# Altium schematic sheet SD_CARD.SchDoc
size A4; SheetNumber: 14; SheetTotal: 15
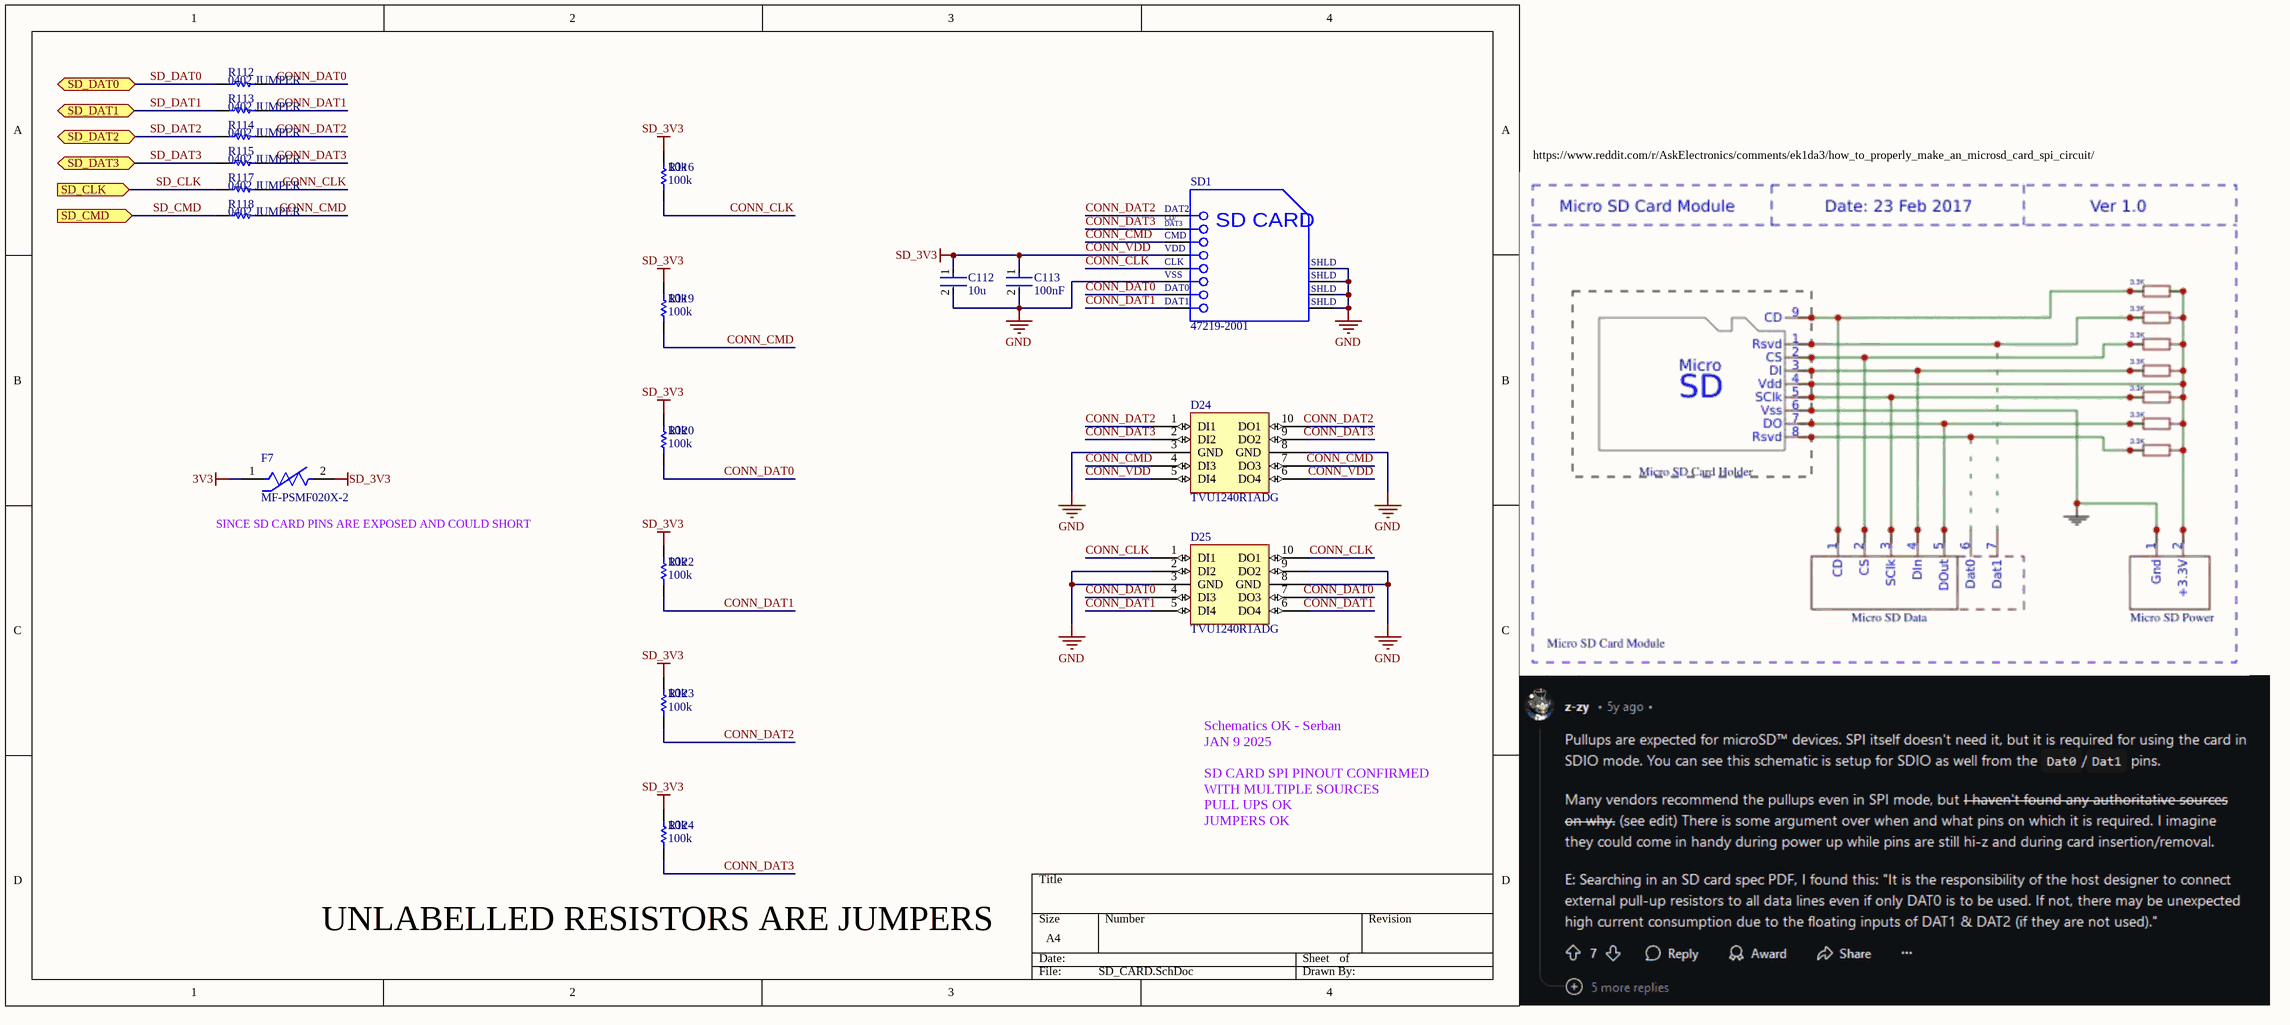
[diagram p0: SD_CARD.SchDoc]

## Parts
C112  10u  [FP-0402-L_1_0_0_05-W_0_5-IPC_A]
C113  100nF  [FP-0402-L_1_0_0_05-W_0_5-IPC_A]
D24  TVU1240R1ADG  [CAF-50P250X100-10N]
D25  TVU1240R1ADG  [CAF-50P250X100-10N]
F7  MF-PSMF020X-2  [FP-MF-PSMF-MFG]
R112  0402 JUMPER  [RESC1005X40X25ML05T05]
R113  0402 JUMPER  [RESC1005X40X25ML05T05]
R114  0402 JUMPER  [RESC1005X40X25ML05T05]
R115  0402 JUMPER  [RESC1005X40X25ML05T05]
R116  100k  value 10k  [R0603B]
R117  0402 JUMPER  [RESC1005X40X25ML05T05]
R118  0402 JUMPER  [RESC1005X40X25ML05T05]
R119  100k  value 10k  [R0603B]
R120  100k  value 10k  [R0603B]
R122  100k  value 10k  [R0603B]
R123  100k  value 10k  [R0603B]
R124  100k  value 10k  [R0603B]
SD1  47219-2001  [MOLX-47219-2001-8_V]

## Ports
SD_CLK (in, see BCM_ECU[5C]), SD_CMD (in, see BCM_ECU[5C]), SD_DAT0 (bidir, see BCM_ECU[5C]), SD_DAT1 (bidir, see BCM_ECU[5C]), SD_DAT2 (bidir, see BCM_ECU[5C]), SD_DAT3 (bidir, see BCM_ECU[5C])

## Nets
3V3: F7.1
CONN_VDD: C112.1 C113.1 D24.5(DI4) D24.6(DO4) F7.2 R116.2 R119.2 R120.2 R122.2 R123.2 R124.2 SD1.4(VDD)  [also labelled SD_3V3]
GND: C112.2 C113.2 D24.3(GND) D24.8(GND) D25.2(DI2) D25.3(GND) D25.8(GND) D25.9(DO2) SD1.6(VSS) SD1.9(SHLD) SD1.10(SHLD) SD1.11(SHLD) SD1.12(SHLD)
CONN_CLK: D25.1(DI1) D25.10(DO1) R116.1 R117.2 SD1.5(CLK)
CONN_CMD: D24.4(DI3) D24.7(DO3) R118.2 R119.1 SD1.3(CMD)
CONN_DAT0: D25.4(DI3) D25.7(DO3) R112.2 R120.1 SD1.7(DAT0)
CONN_DAT1: D25.5(DI4) D25.6(DO4) R113.2 R122.1 SD1.8(DAT1)
CONN_DAT2: D24.1(DI1) D24.10(DO1) R114.2 R123.1 SD1.1(DAT2)
CONN_DAT3: D24.2(DI2) D24.9(DO2) R115.2 R124.1 SD1.2(CD/DAT3)
SD_CLK: R117.1 ; port SD_CLK
SD_CMD: R118.1 ; port SD_CMD
SD_DAT0: R112.1 ; port SD_DAT0
SD_DAT1: R113.1 ; port SD_DAT1
SD_DAT2: R114.1 ; port SD_DAT2
SD_DAT3: R115.1 ; port SD_DAT3

## Notes on the sheet
- https://www.reddit.com/r/AskElectronics/comments/ek1da3/how_to_properly_make_an_microsd_card_spi_circuit/
- (near F7) SINCE SD CARD PINS ARE EXPOSED AND COULD SHORT
- Schematics OK - Serban
  JAN 9 2025
  SD CARD SPI PINOUT CONFIRMED WITH MULTIPLE SOURCES
  PULL UPS OK
  JUMPERS OK
- UNLABELLED RESISTORS ARE JUMPERS
- (in symbol CMP-2000-05245-1) CD/; DAT3; SD CARD

## Library data of the parts
C112 C113 = CMP-001-00058-1: LARGE PADS, 0402 CAP, CHANGE COMMENT TO MATCH REAL P/N; Capacitor Type: Ceramic; Min Operating Temperature: -55°C; Mounting Technology: Surface Mount; Pins: 2; Case/Package: 0402; RoHS Compliant: Yes; Max Operating Temperature: 85°C
D24 D25 = CMP-004-00060-2
F7 = CMP-07400-000005-1: PTC RESET FUSE 9V 200MA 0805; Manufacturer: Bourns; Description: Polymeric PTC Resettable Fuse 9V 200mA Ih Surface Mount 0805 (2012 Metric), Concave; Trip Current: 0.5A; Resistance: 0.65-3.5Ω; Current Rating: 40A; Value: 0.65-3.5Ω; Trip Time: 0.02s; Hold Current: 0.2A; ComponentLink2Description: Datasheet; Manufacturer Part Number: MF-PSMF020X-2; Height: 0.85mm; Ambient Temperature Range High: +85°C; Category: Fuse; Temperature Range Low: -40°C; ComponentLink2URL: https://www.bourns.com/docs/Product-Datasheets/mfpsmf.pdf; Temperature Range High: +85°C; RoHS: TRUE; Device Class L1: Circuit Protection; Device Class L3: unset; Package: MF-PSMF; Digikey Description: PTC RESET FUSE 9V 200MA 0805; Mouser Description: PTC Resettable Fuse 0.2A(hold) 0.5A(trip) 9V 40A 0.5W 0.02s 0.65Ohm SMD Solder Pad 0805 T/R; Voltage Rating: 9V; Automotive: No; Device Class L2: PTC Resettable Fuses; Temperature: -40°C to +85°C; Lead Free: Yes; Octopart: https://octopart.com/mf-psmf020x-2-bourns-7483437; Ambient Temperature Range Low: -40°C
R112-R115 R117 R118 = CMP-009-00118-2: READ THE NAME; Pins: 2; Component Type: Standard; Design Item ID: CMP-009-00206-2; Source: 0402jump.SchLib; Value: 0402 JUMPER
R116 R119 R120 R122-R124 = CMP-009-00002-14: Resistor
SD1 = CMP-2000-05245-1: MicroSD Card Connector, Hinge Type, -40 to 85 degC, 8-Pin SMD, RoHS, Tape and Reel; Manufacturer: Molex; Current Rating: 500mA; Number of Contacts: 8; Pitch: 1.09mm; Insertion - Extraction Style: Hinged; Voltage Rating: 100VDC; Product: CardConnectors; Contact Material: CopperAlloy; Series: 47219; Packaging: Reel; Brand: Molex; Product Category: MemoryCardConnectors; Housing Material: Thermoplastic; Mounting Style: SMD/SMT; Termination Style: SMD; Datasheet Version: Rev. F, 06/2009; Card Type: microSD; Manufacturer URL: http://www.molex.com/; RoHS: Details; Datasheet URL: http://www.molex.com/pdm_docs/sd/472192001_sd.pdf; Factory Pack Quantity: 2400